# EAGLE design Binary_Blaster (EAGLE 6.5.0)
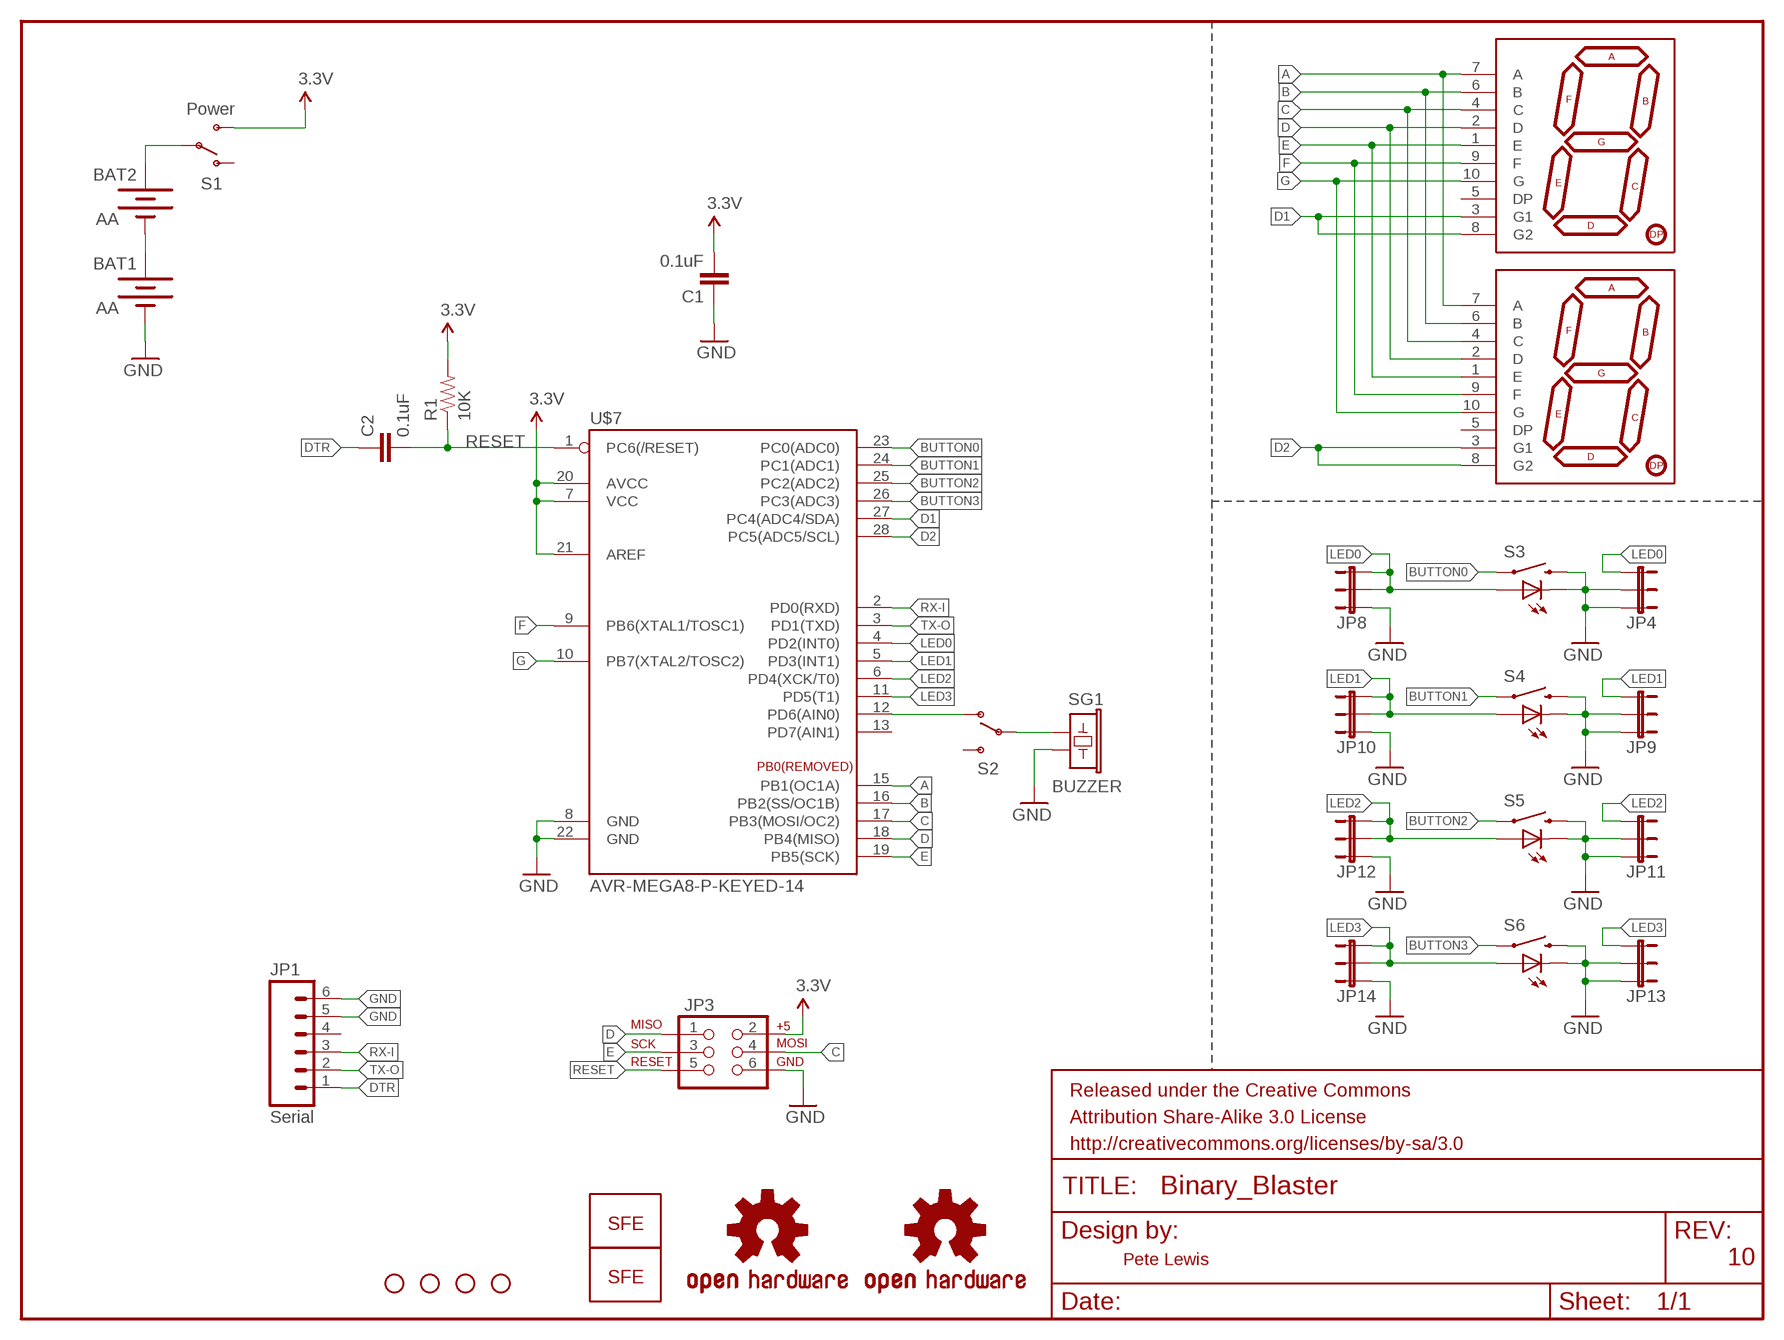
[diagram p0: schematic, sheet 1]

## Parts
BAT1  AA  BATTERYAA-KIT  [BATTERY-AA-KIT]
BAT2  AA  BATTERYAA-KIT  [BATTERY-AA-KIT]
C1  0.1uF  0.1UF-50V-20%(PTH)KIT-EZ  [CAP-PTH-SMALL-KIT]
C2  0.1uF  0.1UF-50V-20%(PTH)KIT-EZ  [CAP-PTH-SMALL-KIT]
FRAME1  FRAME-LETTER  [CREATIVE_COMMONS]
JP1  Serial  M06-SFENOSILK  [1X06-NOSILK]
JP2  STAND-OFF  [STAND-OFF]
JP3  AVR_SPI_PRG_6NS  [2X3-NS]
JP4  JUMPER-3SMD  [SJ_3]
JP5  STAND-OFF  [STAND-OFF]
JP6  STAND-OFF  [STAND-OFF]
JP7  STAND-OFF  [STAND-OFF]
JP8  JUMPER-3SMD  [SJ_3]
JP9  JUMPER-3SMD  [SJ_3]
JP10  JUMPER-3SMD  [SJ_3]
JP11  JUMPER-3SMD  [SJ_3]
JP12  JUMPER-3SMD  [SJ_3]
JP13  JUMPER-3SMD  [SJ_3]
JP14  JUMPER-3SMD  [SJ_3]
LOGO1  LOGO-SFENEW  [SFE-NEW-WEBLOGO]
LOGO2  LOGO-SFENEW  [SFE-NEW-WEBLOGO]
R1  10K  10KOHM1/6W5%(PTH)KIT  [AXIAL-0.3-KIT]
S1  Power  SWITCH-SPDTKIT  [SWITCH-SPDT_KIT]
S2  SWITCH-SPDTKIT  [SWITCH-SPDT_KIT]
S3  SWITCH-MOMENTARY-LEDEZ  [TACTILE-PTH-LED-12MM-EZ]
S4  SWITCH-MOMENTARY-LEDEZ  [TACTILE-PTH-LED-12MM-EZ]
S5  SWITCH-MOMENTARY-LEDEZ  [TACTILE-PTH-LED-12MM-EZ]
S6  SWITCH-MOMENTARY-LEDEZ  [TACTILE-PTH-LED-12MM-EZ]
SG1  BUZZER  BUZZERPTH-KIT  [BUZZER-12MM-KIT]
U$1  7-SEGMENT-DISPLAY-1"-REDEZ  [7-SEGMENT-1"PTH-EZ]
U$2  OSHW-LOGOL  [OSHW-LOGO-L]
U$3  OSHW-LOGOS  [OSHW-LOGO-S]
U$6  7-SEGMENT-DISPLAY-1"-REDEZ  [7-SEGMENT-1"PTH-EZ]
U$7  AVR-MEGA8-P-KEYED-14  [DIL28-3_KEYED-14]

## Nets
3.3V: C1.2 JP3.2 R1.P$2 S1.3(S) U$7.7(VCC) U$7.20(AVCC) U$7.21(AREF)
A: U$1.7(A) U$6.7(A) U$7.15(PB1(OC1A))
B: U$1.6(B) U$6.6(B) U$7.16(PB2(SS/OC1B))
BUTTON0: S3.4 U$7.23(PC0(ADC0))
BUTTON1: S4.4 U$7.24(PC1(ADC1))
BUTTON2: S5.4 U$7.25(PC2(ADC2))
BUTTON3: S6.4 U$7.26(PC3(ADC3))
C: JP3.4 U$1.4(C) U$6.4(C) U$7.17(PB3(MOSI/OC2))
D: JP3.1 U$1.2(D) U$6.2(D) U$7.18(PB4(MISO))
D1: U$1.3(G1) U$1.8(G2) U$7.27(PC4(ADC4/SDA))
D2: U$6.3(G1) U$6.8(G2) U$7.28(PC5(ADC5/SCL))
DTR: C2.1 JP1.1
E: JP3.3 U$1.1(E) U$6.1(E) U$7.19(PB5(SCK))
F: U$1.9(F) U$6.9(F) U$7.9(PB6(XTAL1/TOSC1))
G: U$1.10(G) U$6.10(G) U$7.10(PB7(XTAL2/TOSC2))
GND: BAT1.GND@1(-) C1.1 JP1.5 JP1.6 JP3.6 JP4.2 JP4.3 JP8.1 JP9.2 JP9.3 JP10.1 JP11.2 JP11.3 JP12.1 JP13.2 JP13.3 JP14.1 S3.2 S3.C S4.2 S4.C S5.2 S5.C S6.2 S6.C SG1.- U$7.8(GND) U$7.22(GND)
LED0: JP4.1 JP8.2 JP8.3 S3.A U$7.4(PD2(INT0))
LED1: JP9.1 JP10.2 JP10.3 S4.A U$7.5(PD3(INT1))
LED2: JP11.1 JP12.2 JP12.3 S5.A U$7.6(PD4(XCK/T0))
LED3: JP13.1 JP14.2 JP14.3 S6.A U$7.11(PD5(T1))
N$1: S2.2(P) SG1.+
N$2: BAT2.PWR@1(+) S1.2(P)
N$3: S2.1(O) U$7.12(PD6(AIN0))
N$4: BAT1.PWR@1(+) BAT2.GND@1(-)
RESET: C2.2 JP3.5 R1.P$1 U$7.1(PC6(/RESET))
RX-I: JP1.3 U$7.2(PD0(RXD))
TX-O: JP1.2 U$7.3(PD1(TXD))
Unconnected: JP1.4 S1.1(O) S2.3(S) U$1.5(DP) U$6.5(DP) U$7.13(PD7(AIN1))

## Notes on the sheet
- Pete Lewis | 10

## Library data of the parts
BAT1 BAT2 = SparkFun-Electromechanical:BATTERY: Battery Holders Various common sizes : AA, AAA, 20mm coin cell and 12mm coin cell. 20MM_4LEGS, BATT-10373; PROD_ID: BATT-08316
C1 C2 = SparkFun-Capacitors:0.1UF-50V-20%(PTH): CAP-08370; PROD_ID: CAP-08370
FRAME1 = SparkFun-Aesthetics:FRAME-LETTER: Schematic Frame Standard 8.5x11 US Letter frame
JP1 = unclepetes:M06-SFE: Header 6 Standard 6-pin 0.1" header. Use with straight break away headers (SKU : PRT-00116), right angle break away headers (PRT-00553), swiss pins (PRT-00743), machine pins (PRT-00117), and female headers (PRT-00115). Molex polarized connector foot print use with SKU : PRT-08094 with associated crimp pins and housings. NOTES ON THE VARIANTS LOCK and LOCK_LONGPADS... This footprint was designed to help hold the alignment of a through-hole component (i.e. 6-pin header) while soldering it into place. You may notice that each hole has been shifted either up or down by 0.005 of an inch from it's more standard position (which is a perfectly straight line). This slight alteration caused the pins (the squares in the middle) to touch the edges of the holes. Because they are alternating, it causes a "brace" to hold the component in place. 0.005 has proven to be the perfect amount of "off-center" position when using our standard breakaway headers. Although looks a little odd when you look at the bare footprint, once you have a header in there, the alteration is very hard to notice. Also, if you push a header all the way into place, it is covered up entirely on the bottom side. This idea of altering the position of holes to aid alignment will be further integrated into the Sparkfun Library for other footprints. It can help hold any component with 3 or more connection pins.
JP2 JP5-JP7 = SparkFun:STAND-OFF: Stand Off This is the mechanical footprint for a #4 phillips button head screw. Use the keepout ring to avoid running the screw head into surrounding components. SKU : PRT-00447
JP3 = SparkFun:AVR_SPI_PRG_6: AVR ISP 6 Pin This is the reduced ISP connector for AVR programming. Common on Arduino. This footprint will take up less PCB space and can be used with a 10-pin to 6-pin adapter such as SKU: BOB-08508
JP4 JP8-JP14 = SparkFun-Passives:JUMPER-3
LOGO1 LOGO2 = SparkFun-Aesthetics:LOGO-SFE: Spark Fun Electronics PCB Logo This is the standard Spark Fun Electronics PCB logo.
R1 = SparkFun-Resistors:10KOHM1/6W5%(PTH): RES-08375; PROD_ID: RES-08375
S1 S2 = SparkFun-Electromechanical:SWITCH-SPDT: SPDT Switch Simple slide switch, Spark Fun Electronics SKU : COM-00102 DPDT SMT slide switch, AYZ0202, SWCH-08179; PROD_ID: SWCH-08261
S3-S6 = SparkFun-Electromechanical:SWITCH-MOMENTARY-LED: EZ is for Kits. There is no tStop (covering up the top side of the pads with mask). This helps the beginner see which side they should be soldering too.
SG1 = SparkFun-Electromechanical:BUZZER: Buzzer 12mm Spark Fun Electronics SKU : Comp-Buzzer; PROD_ID: COMP-08253
U$1 U$6 = SparkFun-Displays:7-SEGMENT-DISPLAY-1"-RED: 7-Segment Display 1" Red (COM-08546) EZ is for kits. Pads are only exposed on the bottom side to help prevent soldering in upside down.
U$2 U$3 = SparkFun:OSHW-LOGO: Open Source Hardware Logo This logo indicates the piece of hardware it is found on incorporates a OSHW license and/or adheres to the definition of open source hardware found here: http://freedomdefined.org/OSHW
U$7 = Testing:AVR-MEGA8-P-KEYED-14

## Net classes
0 Default: width 0.254 mm
1 Power: width 0.254 mm
3 ButtonSignal: width 0.254 mm

## Board
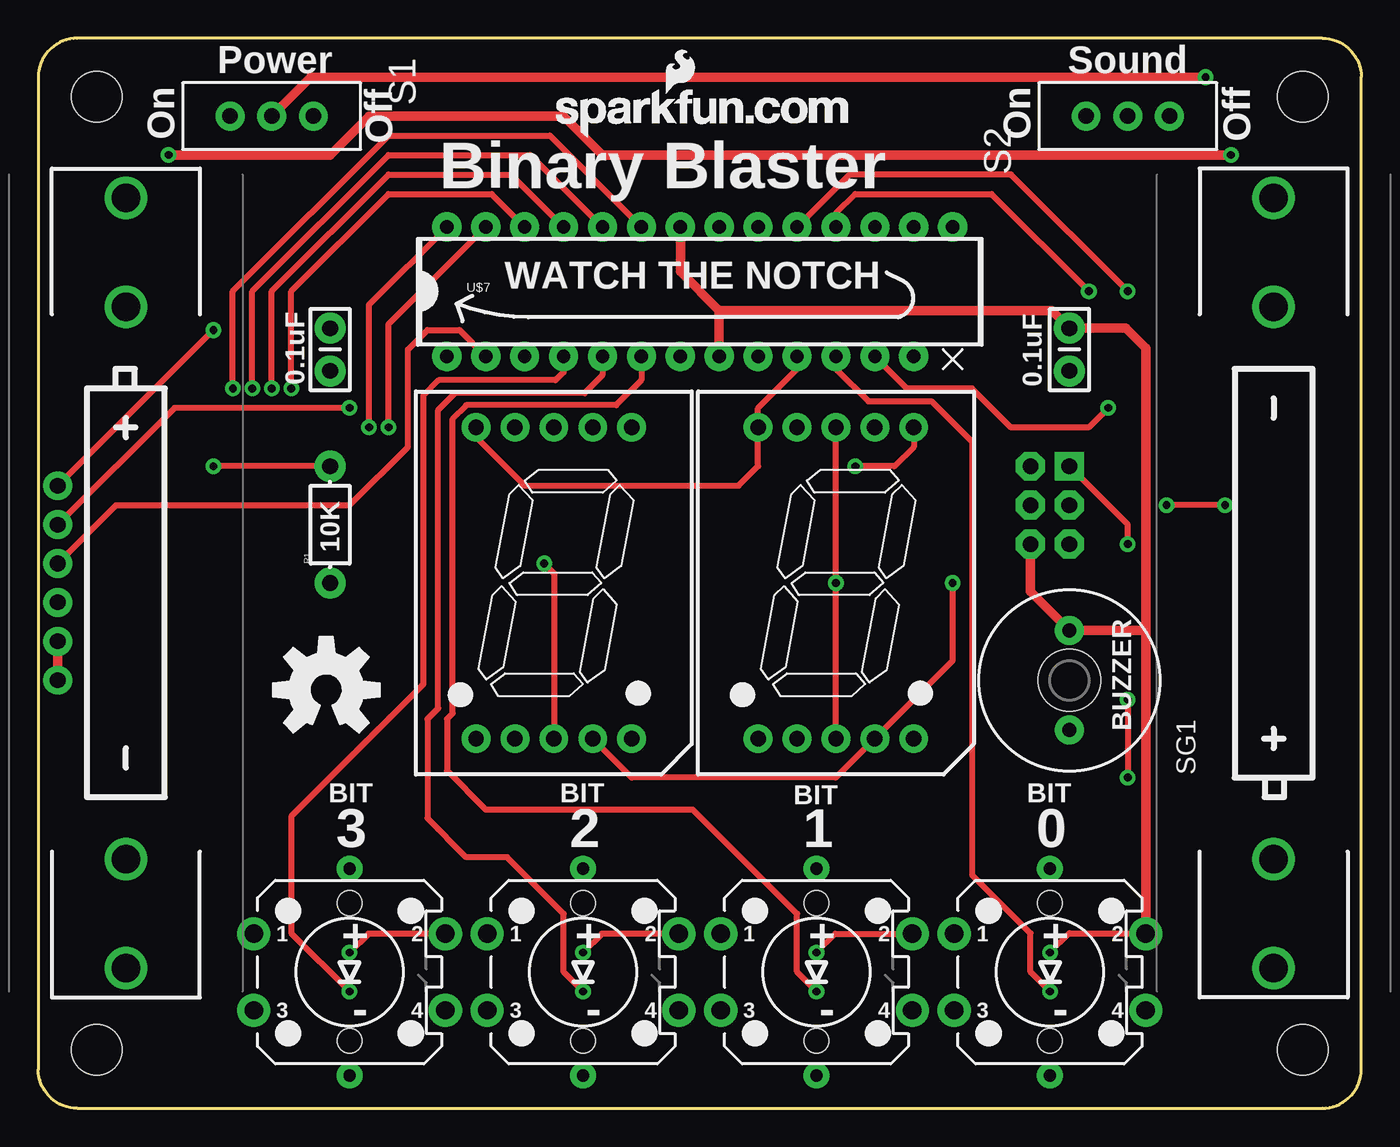
[diagram p1: board, top side]
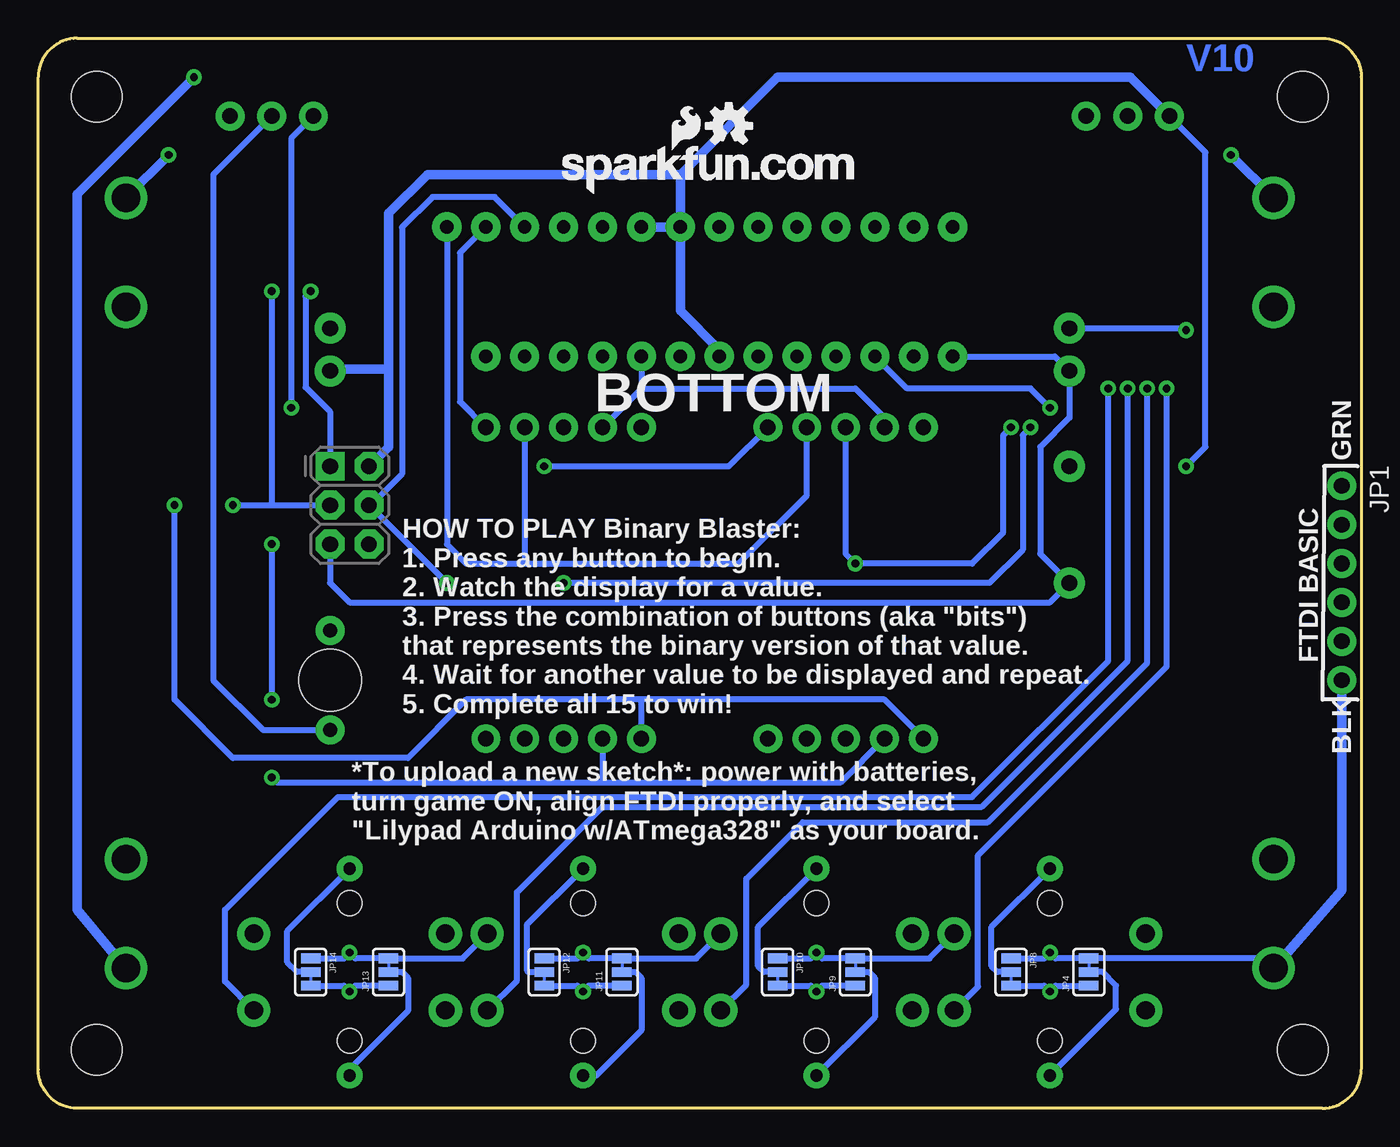
[diagram p2: board, bottom side, seen from below]

Size 86.36 x 69.85 mm. Coordinates in mm from the lower left corner, seen from the top.
Outline: 2.54,0 arc-90 0,2.54 0,67.31 arc-90 2.54,69.85 83.82,69.85 arc-90 86.36,67.31 86.36,2.54 arc-90 83.82,0 2.54,0
Copper layers (1*16): Top 0.035mm / dielectric 1.5mm / Bottom 0.035mm
Design rules "SparkFun-2-layer": minimum track width 7mil, minimum drill 15mil, track to track 8mil, track to pad 8mil, pad to pad 8mil, via to via 8mil, smd to smd 8mil, copper to edge 8mil, drill to drill 8mil, minimum pad ring 12mil, minimum via ring 10mil, stop-mask expansion 4mil, vias tented up to drill 20mil, thermal gap 10mil
Holes 4.06 mm at 67.31,27.94

### Footprints (pad centres in the part's own frame; a part is rotated, then mirrored left to right if it is on the bottom)
BATTERY-AA-KIT = drill 1.854: GND@1 25.146,0; GND@2 18.034,0; PWR@1 -25.146,0; PWR@2 -18.034,0
CAP-PTH-SMALL-KIT = drill 1.016 pad 2.032: 1 -1.397,0; 2 1.397,0
1X06-NOSILK = drill 1.016 pad 1.88: 1 0,0; 2 2.54,0; 3 5.08,0; 4 7.62,0; 5 10.16,0; 6 12.7,0
STAND-OFF = hole 3.302: 0,0
2X3-NS = drill 1.016 pad 1.88 square: 1 -2.54,-1.27 | drill 1.016 pad 1.88 octagon: 2 -2.54,1.27; 3 0,-1.27; 4 0,1.27; 5 2.54,-1.27; 6 2.54,1.27
SJ_3 = smd 0.635 x 1.27: 1 -0.889,0; 2 0,0; 3 0.889,0
AXIAL-0.3-KIT = drill 1.016 pad 2.032: P$1 -3.81,0; P$2 3.81,0
SWITCH-SPDT_KIT = drill 1.016 pad 1.88: 1 0,2.718; 2 0,0; 3 0,-2.718
TACTILE-PTH-LED-12MM-EZ = drill 1.2 pad 2.159: 1 -6.25,2.5; 2 6.25,2.5; 3 -6.25,-2.5; 4 6.25,-2.5 | drill 0.8 pad 1.676: A 0,6.75; C 0,-6.75 | hole 1.6: 0,4.5; 0,-4.5
BUZZER-12MM-KIT = drill 0.9 pad 1.88: + 3.25,0; - -3.25,0
7-SEGMENT-1"PTH-EZ = drill 1 pad 1.88: 1 -5.08,-10.16; 2 -2.54,-10.16; 3 0,-10.16; 4 2.54,-10.16; 5 5.08,-10.16; 6 5.08,10.16; 7 2.54,10.16; 8 0,10.16; 9 -2.54,10.16; 10 -5.08,10.16
DIL28-3_KEYED-14 = drill 0.864 pad 1.905: 1 -16.51,-4.255; 2 -13.97,-4.255; 3 -11.43,-4.255; 4 -8.89,-4.255; 5 -6.35,-4.255; 6 -3.81,-4.255; 7 -1.27,-4.255; 8 1.27,-4.255; 9 3.81,-4.255; 10 6.35,-4.255; 11 8.89,-4.255; 12 11.43,-4.255; 13 13.97,-4.255; 15 16.51,4.191; 16 13.97,4.191; 17 11.43,4.191; 18 8.89,4.191; 19 6.35,4.191; 20 3.81,4.191; 21 1.27,4.191; 22 -1.27,4.191; 23 -3.81,4.191; 24 -6.35,4.191; 25 -8.89,4.191; 26 -11.43,4.191; 27 -13.97,4.191; 28 -16.51,4.191

### Placement (x,y rotation side)
BAT1  5.71,34.29 270 top
BAT2  80.64,34.29 90 top
C1  67.31,49.53 270 top
C2  19.05,49.53 270 top
FRAME1  13.23,-8.89 0 top  (outside the outline)
JP1  1.27,40.64 270 bottom
JP2  82.55,3.81 0 top
JP3  66.04,39.37 270 bottom
JP4  17.78,8.89 90 bottom
JP5  3.81,66.04 0 top
JP6  82.55,66.04 0 top
JP7  3.81,3.81 0 top
JP8  22.86,8.89 270 bottom
JP9  33.02,8.89 90 bottom
JP10  38.1,8.89 270 bottom
JP11  48.26,8.89 90 bottom
JP12  53.34,8.89 270 bottom
JP13  63.5,8.89 90 bottom
JP14  68.58,8.89 270 bottom
LOGO1  33.78,63.37 0 top
LOGO2  52.2,59.69 0 bottom
R1  19.05,38.1 90 top
S1  15.24,64.77 270 top
S2  71.12,64.77 90 top
S3  20.32,8.89 0 top
S4  35.56,8.89 0 top
S5  50.8,8.89 0 top
S6  66.04,8.89 0 top
SG1  67.31,27.94 270 top
U$1  33.66,34.29 0 top
U$2  18.8,27.3 0 top
U$3  41.27,64.14 0 bottom
U$6  52.07,34.29 0 top
U$7  43.18,53.34 0 top

### Tracks (layer width: path | path; a pad name or v marks a point on that pad's centre or on a via)
3.3V  (via drill 0.51)
  Top 0.406: R1.P$2 v11.43,41.91
  Bottom 0.406: v11.43,41.91 10.16,43.18 10.16,62.41 S1.3
  Bottom 0.61: U$7.21 U$7.20 | U$7.21 44.45,52.07 41.91,49.53 U$7.7 | 44.45,60.96 60.96,60.96 63.5,58.42 63.5,48.26 | U$7.21 44.45,60.96 | JP3.2 63.5,43.18 63.5,48.26 | 44.45,60.96 38.1,67.31 15.06,67.31 S1.3 | C1.2 67.18,48.26 63.5,48.26
A
  Bottom 0.406: U$7.15 59.69,36.83 58.42,35.56 54.61,35.56 | 54.61,35.56 40.64,35.56 36.2,40.01 U$1.7 | U$6.7 54.61,35.56
B  (via drill 0.51)
  Top 0.406: U$6.6 57.15,43.18 55.88,41.91 v53.34,41.91
  Bottom 0.406: v53.34,41.91 41.27,41.91 U$1.6 | U$7.16 58.83,55.85 58.83,46.13 U$6.6
BUTTON0  (via drill 0.51)
  Top 0.406: v12.7,46.99 12.7,53.34 22.86,63.5 33.4,63.5 U$7.23
  Bottom 0.406: v12.7,46.99 12.7,28.83 25.02,16.51 25.02,7.94 S3.4
BUTTON1  (via drill 0.51)
  Top 0.406: v13.97,46.99 13.97,53.34 22.86,62.23 32.13,62.23 U$7.24
  Bottom 0.406: v13.97,46.99 13.97,29.08 24.38,18.67 36.45,18.67 40.13,14.99 40.13,8.07 S4.4
BUTTON2  (via drill 0.51)
  Top 0.406: v15.24,46.99 15.24,53.34 22.86,60.96 30.86,60.96 U$7.25
  Bottom 0.406: v15.24,46.99 15.24,29.21 24.77,19.68 49.53,19.68 55.12,14.1 55.12,8.32 S5.4
BUTTON3  (via drill 0.51)
  Top 0.406: v16.51,46.99 16.51,53.34 22.86,59.69 29.59,59.69 U$7.26
  Bottom 0.406: v16.51,46.99 16.51,29.21 25.4,20.32 66.8,20.32 74.17,12.95 74.17,8.27 S6.4
C  (via drill 0.51)
  Top 0.406: v59.69,34.29 59.69,29.21 U$6.4 52.07,21.59 38.73,21.59 U$1.4
  Bottom 0.406: 64.64,39.37 62.61,41.4 62.61,57.51 60.63,59.49 56.57,59.49 U$7.17 | 64.64,39.37 JP3.4 | 64.64,39.37 64.64,39.24 v59.69,34.29
D  (via drill 0.51)
  Top 0.406: v71.12,26.67 v71.12,21.59 | v71.12,36.83 71.12,38.1 JP3.1 | U$7.18 52.07,58.42 53.34,59.69 62.23,59.69 v68.58,53.34
  Bottom 0.406: v71.12,36.83 v71.12,26.67 | U$1.2 33.97,21.27 49.53,21.27 | v68.58,53.34 68.91,53.01 68.91,47.07 67.31,45.47 JP3.1 | v71.12,21.59 70.8,21.27 49.53,21.27 | U$6.2 49.53,21.27
D1  (via drill 0.51)
  Top 0.406: v33.02,35.56 33.66,34.92 U$1.3 | v22.86,44.45 22.86,51.18 U$7.27
  Bottom 0.406: v22.86,44.45 23.37,43.94 23.37,37.59 25.4,35.56 v33.02,35.56 33.66,36.2 U$1.8
D2  (via drill 0.51)
  Top 0.406: U$6.3 v52.07,34.29 U$6.8 | v21.59,44.45 21.59,52.45 U$7.28
  Bottom 0.406: v52.07,34.29 24.26,34.29 22.1,36.45 22.1,43.94 v21.59,44.45
DTR  (via drill 0.51)
  Top 0.406: v11.43,50.8 JP1.1
  Bottom 0.406: C2.1 11.56,50.93 v11.43,50.8
E  (via drill 0.51)
  Top 0.406: v77.47,39.37 v73.66,39.37 | U$7.19 52.96,60.96 63.5,60.96 v71.12,53.34
  Bottom 0.406: v71.12,53.34 71.12,39.37 | 46.99,26.67 31.11,26.67 U$1.1 | 46.99,26.67 58.42,26.67 62.23,22.86 73.66,22.86 77.47,26.67 v77.47,39.37 | v73.66,39.37 71.12,39.37 | 71.12,39.37 JP3.3 | U$6.1 46.99,26.67
F
  Bottom 0.406: U$7.9 46.99,46.99 | 46.99,46.99 U$6.9 | U$1.9 31.11,45.09 33.02,46.99 46.99,46.99
G
  Top 0.406: U$1.10 28.57,43.81 31.75,40.64 45.72,40.64 46.99,41.91 U$6.10 46.99,45.72 49.53,48.26 U$7.10
GND  (via drill 0.51)
  Top 0.406: S3.2 21.55,11.39 v20.32,10.16 | S4.2 36.79,11.39 v35.56,10.16 | v50.8,10.16 52.03,11.39 S5.2 | v66.04,10.16 67.31,11.43 72.25,11.43 S6.2
  Top 0.61: JP1.6 JP1.5 | 72.29,31.19 72.29,49.63 70.99,50.93 C1.1 66.17,52.07 44.45,52.07 | 72.29,31.19 S6.2 | 72.29,31.19 SG1.- 64.77,33.73 JP3.6 | U$7.22 41.91,54.61 44.45,52.07 | 44.45,52.07 U$7.8
  Bottom 0.203: JP4.3 JP4.2 | JP9.3 JP9.2 | JP11.3 JP11.2 | JP13.3 JP13.2
  Bottom 0.406: BAT1.GND@1 6.35,9.78 JP4.3 19.94,9.78 v20.32,10.16 20.7,9.78 JP8.1 | S3.C 16,6.46 16,8 16.89,8.89 JP4.2 | JP9.2 32.13,8.89 31.75,8.51 31.75,5.95 S4.C | S3.2 28.18,9.78 JP9.3 35.18,9.78 v35.56,10.16 35.94,9.78 JP10.1 | S4.2 43.42,9.78 JP11.3 50.42,9.78 v50.8,10.16 51.18,9.78 JP12.1 | S5.C 49.93,2.14 46.99,5.08 46.99,8.51 47.37,8.89 JP11.2 | S6.C 66.04,2.54 62.23,6.35 62.23,8.51 62.61,8.89 JP13.2 | S5.2 58.66,9.78 JP13.3 65.66,9.78 v66.04,10.16 66.42,9.78 JP14.1
  Bottom 0.61: BAT1.GND@1 1.27,14.22 JP1.6
LED0  (via drill 0.51)
  Top 0.406: U$7.4 34.29,48.06 33.76,47.52 26.14,47.52 25.15,46.53 25.15,27.69 16.51,19.05 16.51,11.43 v20.32,7.62
  Bottom 0.203: JP8.2 JP8.3
  Bottom 0.406: JP4.1 19.94,8 v20.32,7.62 20.7,8 JP8.3 | JP8.2 23.75,8.89 24.13,9.27 24.13,11.83 S3.A
LED1  (via drill 0.51)
  Top 0.406: U$7.5 36.83,47.85 35.66,46.69 27.2,46.69 26.11,45.59 26.11,26.11 25.4,25.4 25.4,18.92 27.94,16.38 30.61,16.38 34.29,12.7 34.29,8.89 v35.56,7.62
  Bottom 0.203: JP10.2 JP10.3
  Bottom 0.406: JP9.1 35.18,8 v35.56,7.62 35.94,8 JP10.3 | JP10.2 38.99,8.89 39.37,9.27 39.37,11.83 S4.A
LED2  (via drill 0.51)
  Top 0.406: U$7.6 39.37,47.55 37.72,45.9 27.91,45.9 27.91,45.87 27.05,45.01 27.05,25.78 26.67,25.4 26.67,22.05 29.21,19.51 42.72,19.51 49.53,12.7 49.53,8.89 v50.8,7.62
  Bottom 0.203: JP12.2 JP12.3
  Bottom 0.406: JP11.1 50.42,8 v50.8,7.62 51.18,8 JP12.3 | S5.A 54.48,11.96 54.48,9.02 54.36,8.89 JP12.2
LED3  (via drill 0.51)
  Top 0.406: U$7.11 52.07,48.26 54.18,46.15 58.32,46.15 60.96,43.51 60.96,15.24 64.77,11.43 64.77,8.89 v66.04,7.62
  Bottom 0.203: JP14.2 JP14.3
  Bottom 0.406: JP14.2 69.47,8.89 70.1,9.53 70.1,11.58 S6.A | JP14.3 66.42,8 v66.04,7.62 65.66,8 JP13.1
N$1
  Bottom 0.406: SG1.+ 71.68,24.69 74.93,27.94 74.93,60.96 S2.2
N$2  (via drill 0.51)
  Top 0.61: v76.2,67.31 17.78,67.31 S1.2
  Bottom 0.61: BAT2.PWR@1 83.82,12.95 83.82,59.69 v76.2,67.31
N$3  (via drill 0.51)
  Top 0.406: v69.85,45.72 68.58,44.45 63.5,44.45 60.96,46.99 56.71,46.99 U$7.12
  Bottom 0.406: v69.85,45.72 69.85,63.32 S2.1
N$4  (via drill 0.51)
  Top 0.61: v8.51,62.23 19.05,62.23 21.59,64.77 34.29,64.77 36.83,62.23 v77.85,62.23
  Bottom 0.61: BAT2.GND@1 v77.85,62.23 | BAT1.PWR@1 v8.51,62.23
RESET
  Bottom 0.406: JP3.5 67.31,34.29 66.04,33.02 20.32,33.02 R1.P$1 20.95,36.2 20.95,43.18 19.05,45.09 C2.2 20,49.09 U$7.1
RX-I
  Top 0.406: JP1.3 5.08,39.37 20.32,39.37 24.13,43.18 24.13,49.53 25.4,50.8 27.5,50.8 U$7.2
TX-O  (via drill 0.51)
  Top 0.406: v20.32,45.72 8.89,45.72 JP1.2
  Bottom 0.406: U$7.3 29.65,46.99 21.59,46.99 v20.32,45.72

### Text on the board
Bottom: V10
tPlace: Power | Sound | On | Off | On | Off | Binary Blaster | WATCH THE NOTCH | 0.1uF | 0.1uF | BUZZER | BIT | BIT | BIT | BIT | 3 | 2 | 1 | 0
bPlace: BOTTOM | GRN | FTDI BASIC | HOW TO PLAY Binary Blaster: / 1. Press any button to begin. / 2. Watch the display for a value. / 3. Press the combination of buttons (aka "bits") / that represents the binary version of that value. / 4. Wait for another value to be displayed and repeat. / 5. Complete all 15 to win! | BLK | *To upload a new sketch*: power with batteries, / turn game ON, align FTDI properly, and select / "Lilypad Arduino w/ATmega328" as your board.
tValues: Clip | Pete Lewis